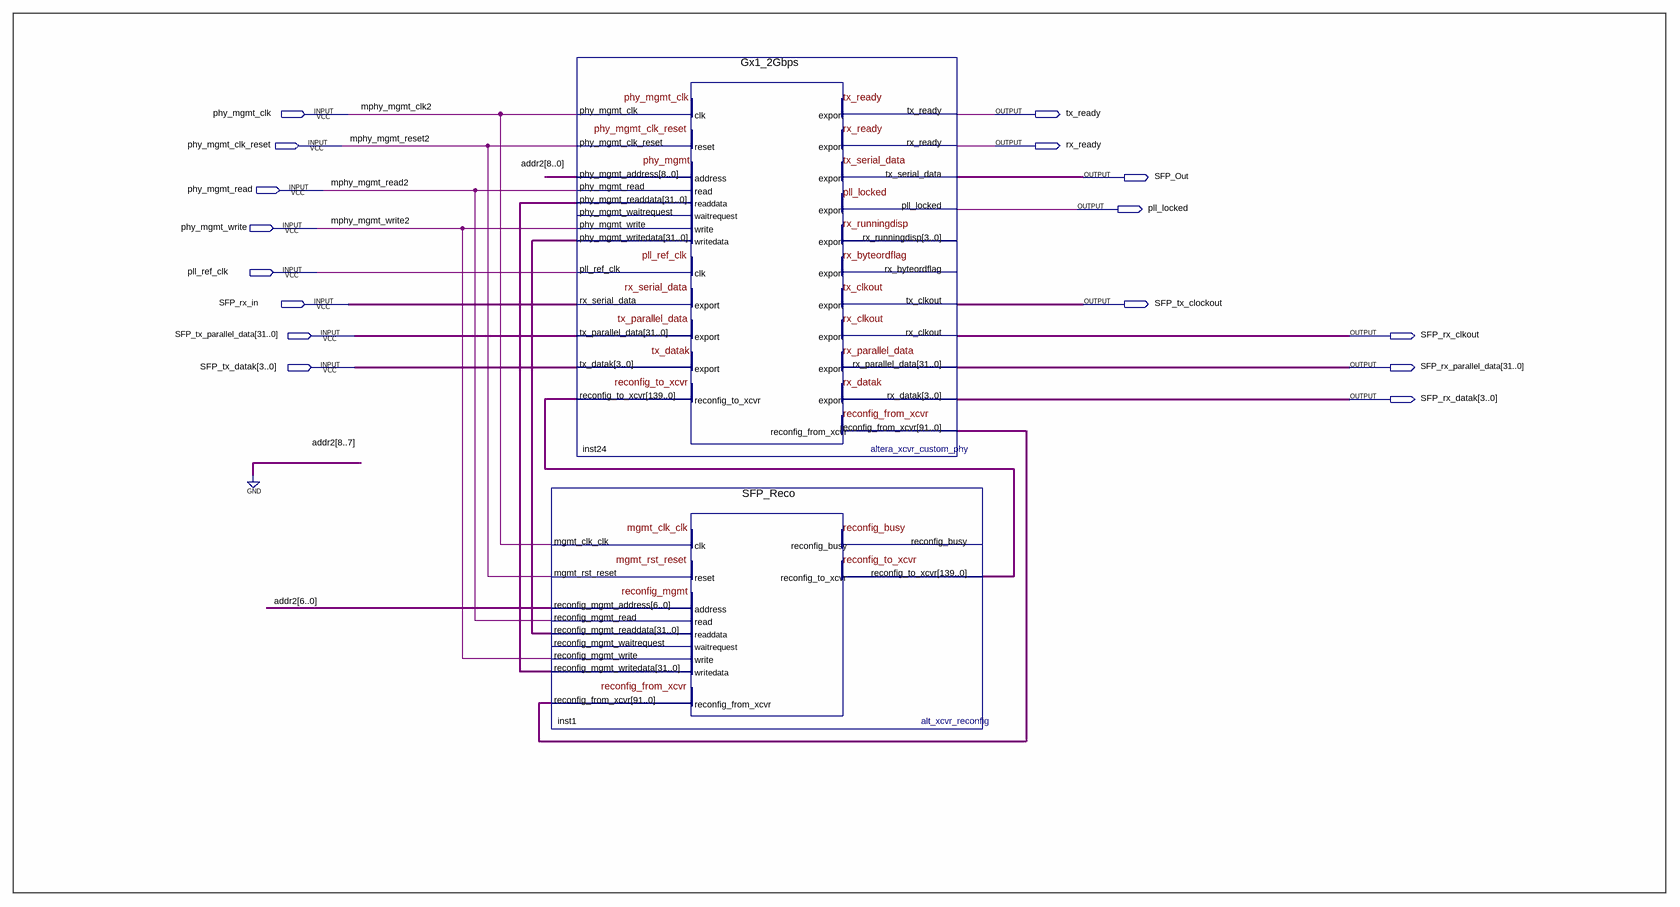
[diagram p0: schematic sheet]
// Quartus schematic SFP_GxBlock.bdf as structural Verilog: 2 symbols, 16 pins
module SFP_GxBlock (
  input  phy_mgmt_clk,
  input  phy_mgmt_clk_reset,
  input  phy_mgmt_read,
  input  phy_mgmt_write,
  input  pll_ref_clk,
  input  SFP_rx_in,
  input  [31:0] SFP_tx_parallel_data,
  input  [3:0] SFP_tx_datak,
  output tx_ready,
  output rx_ready,
  output SFP_Out,
  output pll_locked,
  output SFP_tx_clockout,
  output SFP_rx_clkout,
  output [31:0] SFP_rx_parallel_data,
  output [3:0] SFP_rx_datak
);

  wire [6:0] addr2;
  wire [31:0] inst1_reconfig_mgmt_readdata, inst24_phy_mgmt_readdata;
  wire [91:0] inst24_reconfig_from_xcvr;
  wire [139:0] inst1_reconfig_to_xcvr;

  Gx1_2Gbps inst24 (
    .phy_mgmt_clk(phy_mgmt_clk), .phy_mgmt_clk_reset(phy_mgmt_clk_reset), .phy_mgmt_address({2'b00, addr2}),
    .phy_mgmt_read(phy_mgmt_read), .phy_mgmt_write(phy_mgmt_write),
    .phy_mgmt_writedata(inst1_reconfig_mgmt_readdata), .pll_ref_clk(pll_ref_clk), .rx_serial_data(SFP_rx_in),
    .tx_parallel_data(SFP_tx_parallel_data), .tx_datak(SFP_tx_datak),
    .reconfig_to_xcvr(inst1_reconfig_to_xcvr), .phy_mgmt_readdata(inst24_phy_mgmt_readdata),
    .tx_ready(tx_ready), .rx_ready(rx_ready), .tx_serial_data(SFP_Out), .pll_locked(pll_locked),
    .tx_clkout(SFP_tx_clockout), .rx_clkout(SFP_rx_clkout), .rx_parallel_data(SFP_rx_parallel_data),
    .rx_datak(SFP_rx_datak), .reconfig_from_xcvr(inst24_reconfig_from_xcvr));  // open: phy_mgmt_waitrequest, rx_runningdisp, rx_byteordflag
  SFP_Reco inst1 (
    .mgmt_clk_clk(phy_mgmt_clk), .mgmt_rst_reset(phy_mgmt_clk_reset), .reconfig_mgmt_address(addr2),
    .reconfig_mgmt_read(phy_mgmt_read), .reconfig_mgmt_write(phy_mgmt_write),
    .reconfig_mgmt_writedata(inst24_phy_mgmt_readdata), .reconfig_from_xcvr(inst24_reconfig_from_xcvr),
    .reconfig_mgmt_readdata(inst1_reconfig_mgmt_readdata), .reconfig_to_xcvr(inst1_reconfig_to_xcvr));  // open: reconfig_busy, reconfig_mgmt_waitrequest

  // Other names for the same wires on the sheet: mphy_mgmt_clk2 = phy_mgmt_clk; mphy_mgmt_read2 = phy_mgmt_read;
  //   mphy_mgmt_reset2 = phy_mgmt_clk_reset; mphy_mgmt_write2 = phy_mgmt_write
endmodule
